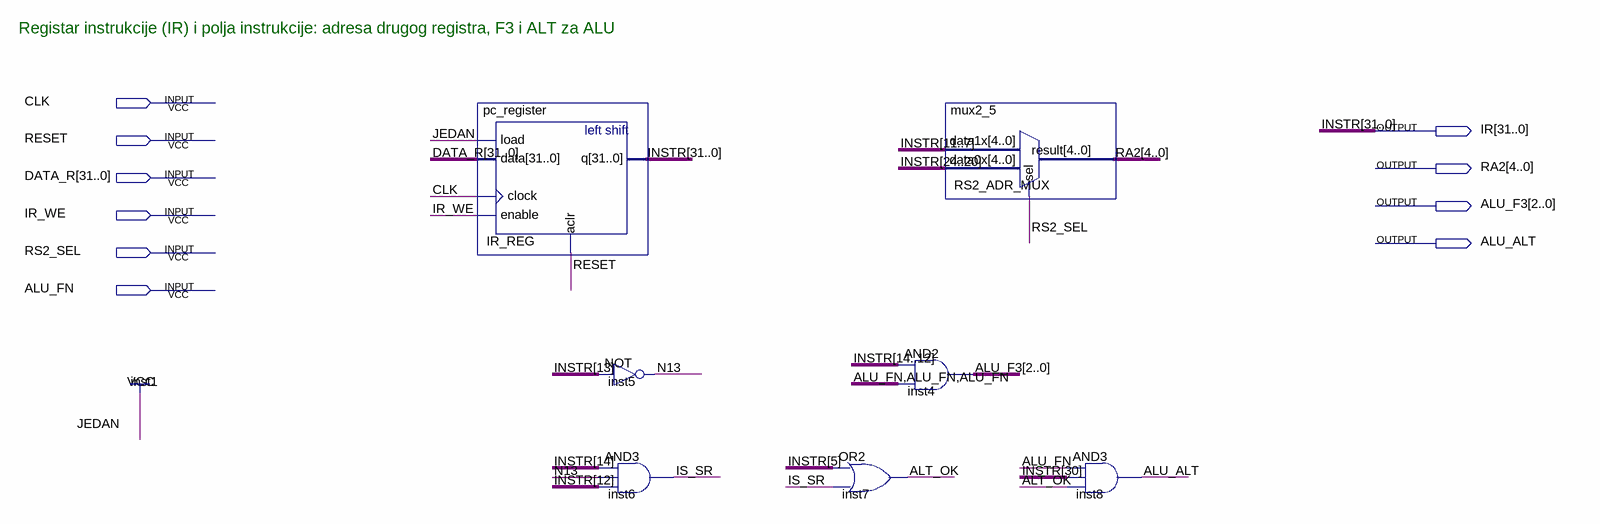
[diagram p0: schematic sheet]
// Quartus schematic instruction.bdf as structural Verilog: 7 symbols, 10 pins
module instruction (
  input  CLK,
  input  RESET,
  input  [31:0] DATA_R,
  input  IR_WE,
  input  RS2_SEL,
  input  ALU_FN,
  output [31:0] IR,
  output [4:0] RA2,
  output [2:0] ALU_F3,
  output ALU_ALT
);

  wire ALT_OK, IS_SR, N13;

  pc_register IR_REG (.load(1'b1), .data(DATA_R), .clock(CLK), .enable(IR_WE), .aclr(RESET), .q(IR));
  not inst5 (N13, IR[13]);
  and inst6 (IS_SR, IR[14], N13, IR[12]);
  or inst7 (ALT_OK, IR[5], IS_SR);
  assign ALU_F3 = IR[14:12] & {3{ALU_FN}};  // AND2 inst4, 3 bits wide
  mux2_5 RS2_ADR_MUX (.data1x(IR[11:7]), .data0x(IR[24:20]), .sel(RS2_SEL), .result(RA2));
  and inst8 (ALU_ALT, ALU_FN, IR[30], ALT_OK);

  // Other names for the same wires on the sheet: INSTR[31:0] = IR

  // Notes on the sheet:
  //   Registar instrukcije (IR) i polja instrukcije: adresa drugog registra, F3 i ALT za ALU
endmodule
